# EAGLE schematic hermesONE v2.0 (EAGLE 9.4.2)
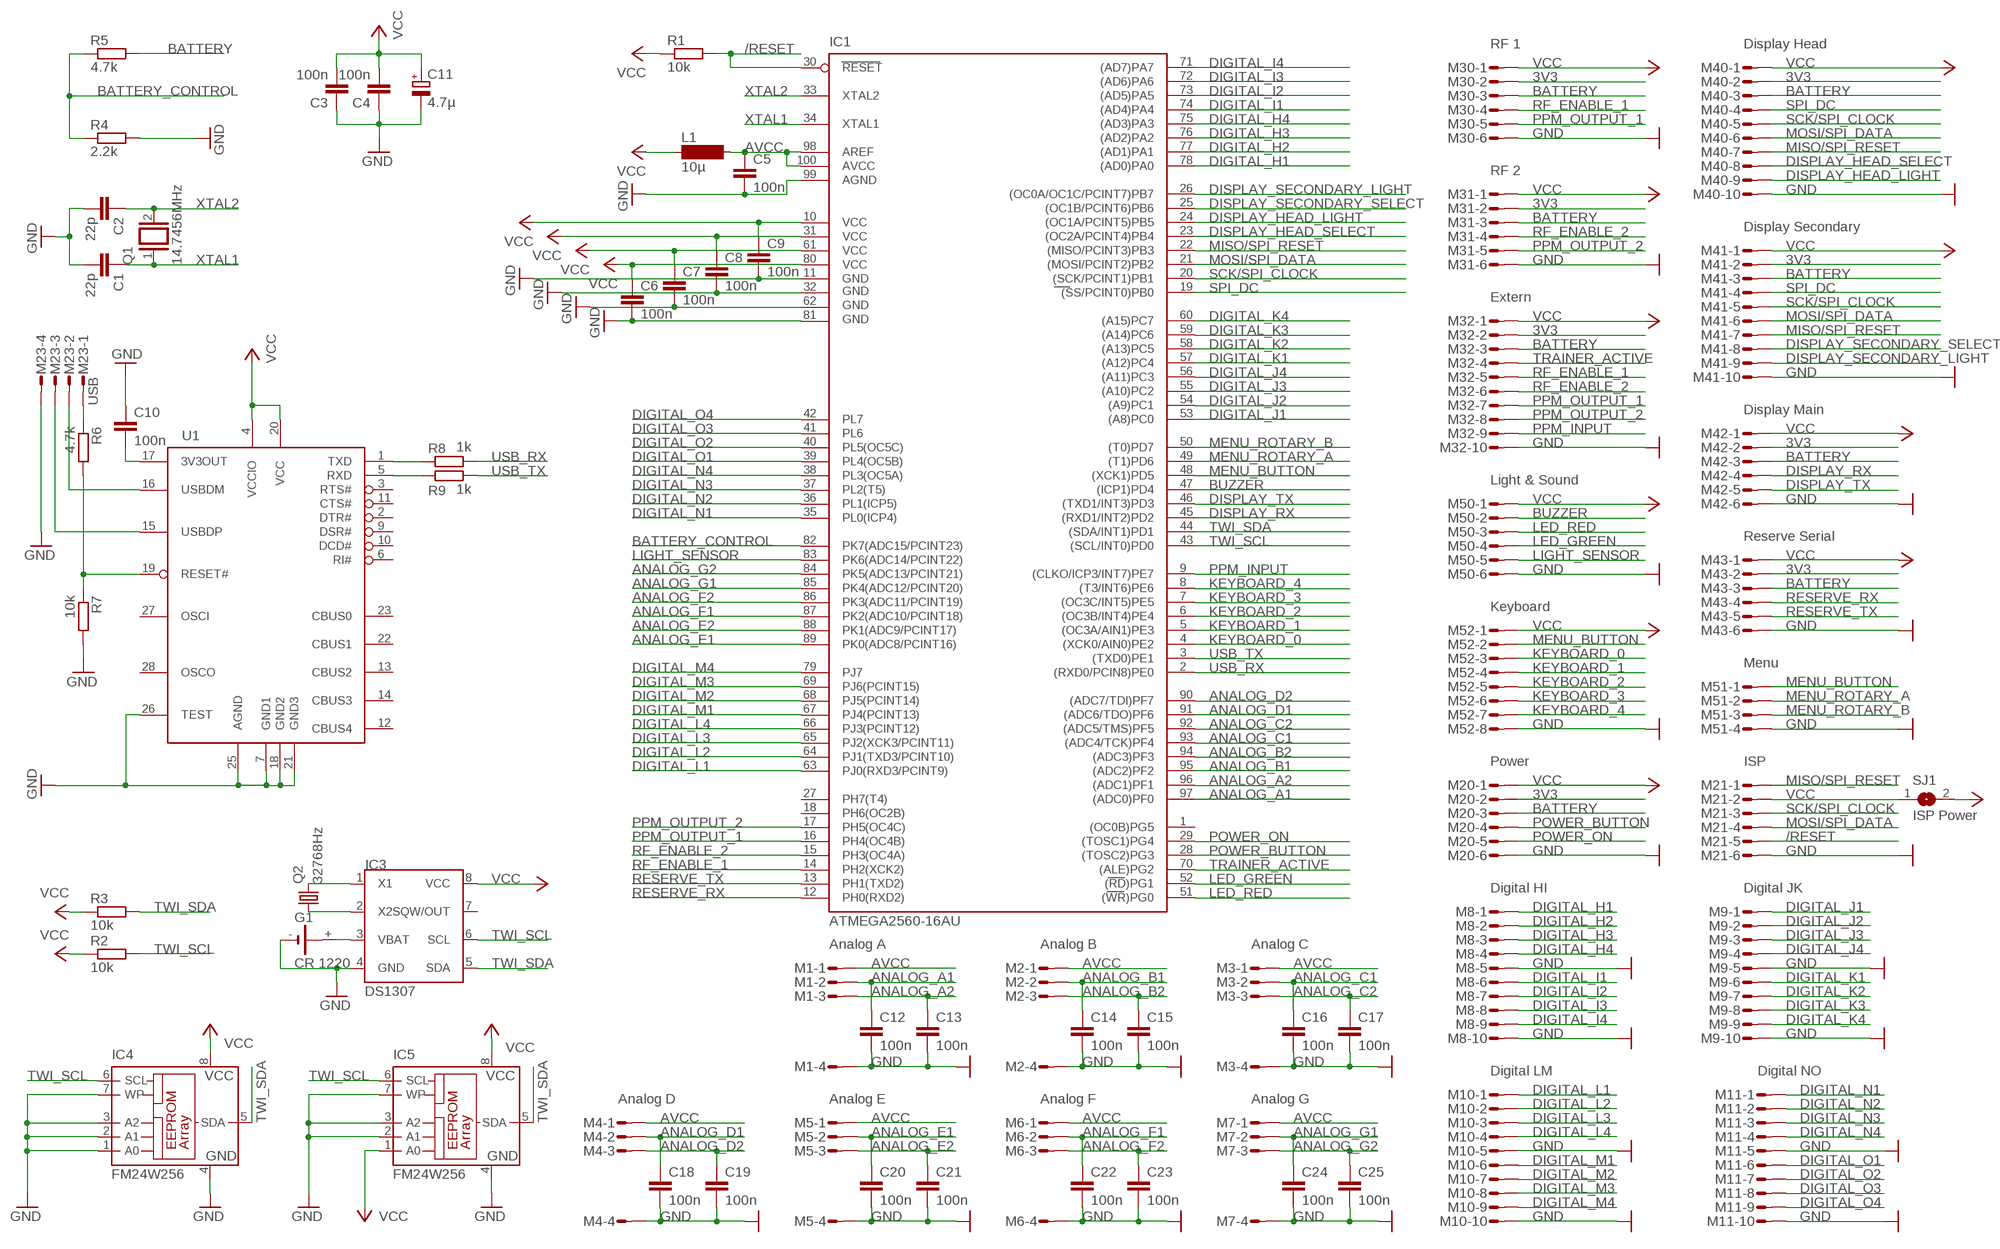
[diagram p0: schematic, sheet 1]

## Parts
C1  22p  C-EUC0603  [C0603]
C2  22p  C-EUC0603  [C0603]
C3  100n  C-EUC0603  [C0603]
C4  100n  C-EUC0603  [C0603]
C5  100n  C-EUC0603  [C0603]
C6  100n  C-EUC0603  [C0603]
C7  100n  C-EUC0603  [C0603]
C8  100n  C-EUC0603  [C0603]
C9  100n  C-EUC0603  [C0603]
C10  100n  C-EUC0603  [C0603]
C11  4.7µ  CPOL-EUB  [PANASONIC_B]
C12  100n  C-EUC0603  [C0603]
C13  100n  C-EUC0603  [C0603]
C14  100n  C-EUC0603  [C0603]
C15  100n  C-EUC0603  [C0603]
C16  100n  C-EUC0603  [C0603]
C17  100n  C-EUC0603  [C0603]
C18  100n  C-EUC0603  [C0603]
C19  100n  C-EUC0603  [C0603]
C20  100n  C-EUC0603  [C0603]
C21  100n  C-EUC0603  [C0603]
C22  100n  C-EUC0603  [C0603]
C23  100n  C-EUC0603  [C0603]
C24  100n  C-EUC0603  [C0603]
C25  100n  C-EUC0603  [C0603]
G1  CR 1220  1220  [KZH12THM]
IC1  ATMEGA2560-16AU  [TQFP100]
IC3  DS1307  [SOIC-8]
IC4  FM24W256  24C64SM  [SO-08M]
IC5  FM24W256  24C64SM  [SO-08M]
L1  10µ  SM-1206  [SM-1206]
M1  Analog A  MT-4  [MT-4]
M2  Analog B  MT-4  [MT-4]
M3  Analog C  MT-4  [MT-4]
M4  Analog D  MT-4  [MT-4]
M5  Analog E  MT-4  [MT-4]
M6  Analog F  MT-4  [MT-4]
M7  Analog G  MT-4  [MT-4]
M8  Digital HI  MT-10  [MT-10]
M9  Digital JK  MT-10  [MT-10]
M10  Digital LM  MT-10  [MT-10]
M11  Digital NO  MT-10  [MT-10]
M20  Power  MT-6  [MT-6]
M21  ISP  MT-6  [MT-6]
M23  USB  MT-4  [MT-4]
M30  RF 1  MT-6  [MT-6]
M31  RF 2  MT-6  [MT-6]
M32  Extern  MT-10  [MT-10]
M40  Display Head  MT-10  [MT-10]
M41  Display Secondary  MT-10  [MT-10]
M42  Display Main  MT-6  [MT-6]
M43  Reserve Serial  MT-6  [MT-6]
M50  Light & Sound  MT-6  [MT-6]
M51  Menu  MT-4  [MT-4]
M52  Keyboard  MT-8  [MT-8]
Q1  14.7456MHz  XTAL/S  [QS]
Q2  32768Hz  CRYSTALTC26H  [TC26H]
R1  10k  R-EU_R0603  [R0603]
R2  10k  R-EU_R0603  [R0603]
R3  10k  R-EU_R0603  [R0603]
R4  2.2k  R-EU_R0603  [R0603]
R5  4.7k  R-EU_R0603  [R0603]
R6  4.7k  R-EU_R0603  [R0603]
R7  10k  R-EU_R0603  [R0603]
R8  1k  R-EU_R0603  [R0603]
R9  1k  R-EU_R0603  [R0603]
SJ1  ISP Power  SJ  [SJ]
U1  FT232R  FT232RL  [SSOP28DB]

## Nets
3V3: M20.2 M30.2 M31.2 M32.2 M40.2 M41.2 M42.2 M43.2
3V3OUT: C10.2 U1.17(3V3OUT)
/RESET: IC1.30(RESET) M21.5 R1.2
ANALOG_A1: C12.1 IC1.97((ADC0)PF0) M1.2
ANALOG_A2: C13.1 IC1.96((ADC1)PF1) M1.3
ANALOG_B1: C14.1 IC1.95((ADC2)PF2) M2.2
ANALOG_B2: C15.1 IC1.94((ADC3)PF3) M2.3
ANALOG_C1: C16.1 IC1.93((ADC4/TCK)PF4) M3.2
ANALOG_C2: C17.1 IC1.92((ADC5/TMS)PF5) M3.3
ANALOG_D1: C18.1 IC1.91((ADC6/TDO)PF6) M4.2
ANALOG_D2: C19.1 IC1.90((ADC7/TDI)PF7) M4.3
ANALOG_E1: C20.1 IC1.89(PK0(ADC8/PCINT16)) M5.2
ANALOG_E2: C21.1 IC1.88(PK1(ADC9/PCINT17)) M5.3
ANALOG_F1: C22.1 IC1.87(PK2(ADC10/PCINT18)) M6.2
ANALOG_F2: C23.1 IC1.86(PK3(ADC11/PCINT19)) M6.3
ANALOG_G1: C24.1 IC1.85(PK4(ADC12/PCINT20)) M7.2
ANALOG_G2: C25.1 IC1.84(PK5(ADC13/PCINT21)) M7.3
AVCC: C5.1 IC1.98(AREF) IC1.100(AVCC) L1.2 M1.1 M2.1 M3.1 M4.1 M5.1 M6.1 M7.1
BATTERY: M20.3 M30.3 M31.3 M32.3 M40.3 M41.3 M42.3 M43.3 R5.2
BATTERY_CONTROL: IC1.82(PK7(ADC15/PCINT23)) R4.1 R5.1
BUZZER: IC1.47((ICP1)PD4) M50.2
D+: M23.3 U1.15(USBDP)
D-: M23.2 U1.16(USBDM)
DIGITAL_H1: IC1.78((AD0)PA0) M8.1
DIGITAL_H2: IC1.77((AD1)PA1) M8.2
DIGITAL_H3: IC1.76((AD2)PA2) M8.3
DIGITAL_H4: IC1.75((AD3)PA3) M8.4
DIGITAL_I1: IC1.74((AD4)PA4) M8.6
DIGITAL_I2: IC1.73((AD5)PA5) M8.7
DIGITAL_I3: IC1.72((AD6)PA6) M8.8
DIGITAL_I4: IC1.71((AD7)PA7) M8.9
DIGITAL_J1: IC1.53((A8)PC0) M9.1
DIGITAL_J2: IC1.54((A9)PC1) M9.2
DIGITAL_J3: IC1.55((A10)PC2) M9.3
DIGITAL_J4: IC1.56((A11)PC3) M9.4
DIGITAL_K1: IC1.57((A12)PC4) M9.6
DIGITAL_K2: IC1.58((A13)PC5) M9.7
DIGITAL_K3: IC1.59((A14)PC6) M9.8
DIGITAL_K4: IC1.60((A15)PC7) M9.9
DIGITAL_L1: IC1.63(PJ0(RXD3/PCINT9)) M10.1
DIGITAL_L2: IC1.64(PJ1(TXD3/PCINT10)) M10.2
DIGITAL_L3: IC1.65(PJ2(XCK3/PCINT11)) M10.3
DIGITAL_L4: IC1.66(PJ3(PCINT12)) M10.4
DIGITAL_M1: IC1.67(PJ4(PCINT13)) M10.6
DIGITAL_M2: IC1.68(PJ5(PCINT14)) M10.7
DIGITAL_M3: IC1.69(PJ6(PCINT15)) M10.8
DIGITAL_M4: IC1.79(PJ7) M10.9
DIGITAL_N1: IC1.35(PL0(ICP4)) M11.1
DIGITAL_N2: IC1.36(PL1(ICP5)) M11.2
DIGITAL_N3: IC1.37(PL2(T5)) M11.3
DIGITAL_N4: IC1.38(PL3(OC5A)) M11.4
DIGITAL_O1: IC1.39(PL4(OC5B)) M11.6
DIGITAL_O2: IC1.40(PL5(OC5C)) M11.7
DIGITAL_O3: IC1.41(PL6) M11.8
DIGITAL_O4: IC1.42(PL7) M11.9
DISPLAY_HEAD_LIGHT: IC1.24((OC1A/PCINT5)PB5) M40.9
DISPLAY_HEAD_SELECT: IC1.23((OC2A/PCINT4)PB4) M40.8
DISPLAY_RX: IC1.45((RXD1/INT2)PD2) M42.4
DISPLAY_SECONDARY_LIGHT: IC1.26((OC0A/OC1C/PCINT7)PB7) M41.9
DISPLAY_SECONDARY_SELECT: IC1.25((OC1B/PCINT6)PB6) M41.8
DISPLAY_TX: IC1.46((TXD1/INT3)PD3) M42.5
GND: C1.2 C2.2 C3.1 C4.1 C5.2 C6.2 C7.2 C8.2 C9.2 C10.1 C11.- C12.2 C13.2 C14.2 C15.2 C16.2 C17.2 C18.2 C19.2 C20.2 C21.2 C22.2 C23.2 C24.2 C25.2 G1.- IC1.11(GND) IC1.32(GND1) IC1.62(GND2) IC1.81(GND3) IC1.99(AGND) IC3.4(GND) IC4.1(A0) IC4.2(A1) IC4.3(A2) IC4.4(GND) IC4.7(WP) IC5.2(A1) IC5.3(A2) IC5.4(GND) IC5.7(WP) M1.4 M2.4 M3.4 M4.4 M5.4 M6.4 M7.4 M8.5 M8.10 M9.5 M9.10 M10.5 M10.10 M11.5 M11.10 M20.6 M21.6 M23.4 M30.6 M31.6 M32.10 M40.10 M41.10 M42.6 M43.6 M50.6 M51.4 M52.8 R4.2 R7.2 U1.7(GND1) U1.18(GND2) U1.21(GND3) U1.25(AGND) U1.26(TEST)
ISP_VCC: M21.2 SJ1.1
KEYBOARD_0: IC1.4((XCK0/AIN0)PE2) M52.3
KEYBOARD_1: IC1.5((OC3A/AIN1)PE3) M52.4
KEYBOARD_2: IC1.6((OC3B/INT4)PE4) M52.5
KEYBOARD_3: IC1.7((OC3C/INT5)PE5) M52.6
KEYBOARD_4: IC1.8((T3/INT6)PE6) M52.7
LED_GREEN: IC1.52((RD)PG1) M50.4
LED_RED: IC1.51((WR)PG0) M50.3
LIGHT_SENSOR: IC1.83(PK6(ADC14/PCINT22)) M50.5
MENU_BUTTON: IC1.48((XCK1)PD5) M51.1 M52.2
MENU_ROTARY_A: IC1.49((T1)PD6) M51.2
MENU_ROTARY_B: IC1.50((T0)PD7) M51.3
MISO/SPI_RESET: IC1.22((MISO/PCINT3)PB3) M21.1 M40.7 M41.7
MOSI/SPI_DATA: IC1.21((MOSI/PCINT2)PB2) M21.4 M40.6 M41.6
POWER_BUTTON: IC1.28((TOSC2)PG3) M20.4
POWER_ON: IC1.29((TOSC1)PG4) M20.5
PPM_INPUT: IC1.9((CLKO/ICP3/INT7)PE7) M32.9
PPM_OUTPUT_1: IC1.16(PH4(OC4B)) M30.5 M32.7
PPM_OUTPUT_2: IC1.17(PH5(OC4C)) M31.5 M32.8
RESERVE_RX: IC1.12(PH0(RXD2)) M43.4
RESERVE_TX: IC1.13(PH1(TXD2)) M43.5
RF_ENABLE_1: IC1.14(PH2(XCK2)) M30.4 M32.5
RF_ENABLE_2: IC1.15(PH3(OC4A)) M31.4 M32.6
RXD: R9.1 U1.5(RXD)
SCK/SPI_CLOCK: IC1.20((SCK/PCINT1)PB1) M21.3 M40.5 M41.5
SPI_DC: IC1.19((SS/PCINT0)PB0) M40.4 M41.4
TRAINER_ACTIVE: IC1.70((ALE)PG2) M32.4
TWI_SCL: IC1.43((SCL/INT0)PD0) IC3.6(SCL) IC4.6(SCL) IC5.6(SCL) R2.2
TWI_SDA: IC1.44((SDA/INT1)PD1) IC3.5(SDA) IC4.5(SDA) IC5.5(SDA) R3.2
TXD: R8.1 U1.1(TXD)
USB_RESET: R6.2 R7.1 U1.19(RESET#)
USB_RX: IC1.2((RXD0/PCIN8)PE0) R8.2
USB_TX: IC1.3((TXD0)PE1) R9.2
USB_VCC: M23.1 R6.1
VBAT: G1.+ IC3.3(VBAT)
VCC: C3.2 C4.2 C6.1 C7.1 C8.1 C9.1 C11.+ IC1.10(VCC) IC1.31(VCC1) IC1.61(VCC2) IC1.80(VCC3) IC3.8(VCC) IC4.8(VCC) IC5.1(A0) IC5.8(VCC) L1.1 M20.1 M30.1 M31.1 M32.1 M40.1 M41.1 M42.1 M43.1 M50.1 M52.1 R1.1 R2.1 R3.1 SJ1.2 U1.4(VCCIO) U1.20(VCC)
X1: IC3.1(X1) Q2.2
X2: IC3.2(X2) Q2.1
XTAL1: C1.1 IC1.34(XTAL1) Q1.1
XTAL2: C2.1 IC1.33(XTAL2) Q1.2
Unconnected: IC1.1((OC0B)PG5) IC1.18(PH6(OC2B)) IC1.27(PH7(T4)) IC3.7(SQW/OUT) U1.2(DTR#) U1.3(RTS#) U1.6(RI#) U1.9(DSR#) U1.10(DCD#) U1.11(CTS#) U1.12(CBUS4) U1.13(CBUS2) U1.14(CBUS3) U1.22(CBUS1) U1.23(CBUS0) U1.27(OSCI) U1.28(OSCO)

## Library data of the parts
C1-C10 C12-C25 = resistor:C-EU: CAPACITOR, European symbol
C11 = resistor:CPOL-EU: POLARIZED CAPACITOR, European symbol
G1 = kzh12_lithium_batterie_holder:1220
IC1 = atmel-2005:ATMEGA*: MICROCONTROLLER 64/128/256 Kbytes FLASH 4 Kbytes EEPROM 8 Kbytes SRAM 86 General Purpose I/O pins 12-channels16-bit PWM 4 x Serial USARTs 16-channels 10-bit A/D
IC3 = dallas:DS1307: I2C Serial RTC w/56 bytes battery backed RAM
IC4 IC5 = microchip:24*: Serial EEPROM I2C; MF: RAMTRON INTERNATIONAL CORP; MPN: FM24C64-S; OC_FARNELL: 9882685; OC_NEWARK: 98H0189
L1 = inductor-neosid:SM-1206: INDUCTOR SMD chip inductor; OC_FARNELL: unknown; OC_NEWARK: unknown
M1-M7 M23 M51 = pst-con-amp-micromatch:MT-4: MT 4 7-215079-4 / 0-215079-4; MPN: 7-215079-4
M8-M11 M32 M40 M41 = pst-con-amp-micromatch:MT-10: MT 10 8-215079-0 / 1-215079-0; MF: FARNELL; MPN: 8-215079-0
M20 M21 M30 M31 M42 M43 M50 = pst-con-amp-micromatch:MT-6: MT 6 7-215079-6 / 0-215079-6; MPN: 7-215079-6
M52 = pst-con-amp-micromatch:MT-8: MT 8 7-215079-8 / 0-215079-8; MF: FARNELL; MPN: 7-215079-8
Q1 = special:XTAL/S: CRYSTAL
Q2 = crystal:CRYSTAL: CRYSTAL; OC_FARNELL: unknown; OC_NEWARK: unknown
R1-R9 = resistor:R-EU_: RESISTOR, European symbol
SJ1 = jumper:SJ: SMD solder JUMPER
U1 = ftdichip-5:FT232RL: USB UART 4th Generation USB UART (USB <-> Serial) Controller

## Net classes
0 default: width 0.254 mm